# Altium schematic sheet BT2.SchDoc
size A4; SheetNumber: 3; SheetTotal: 3
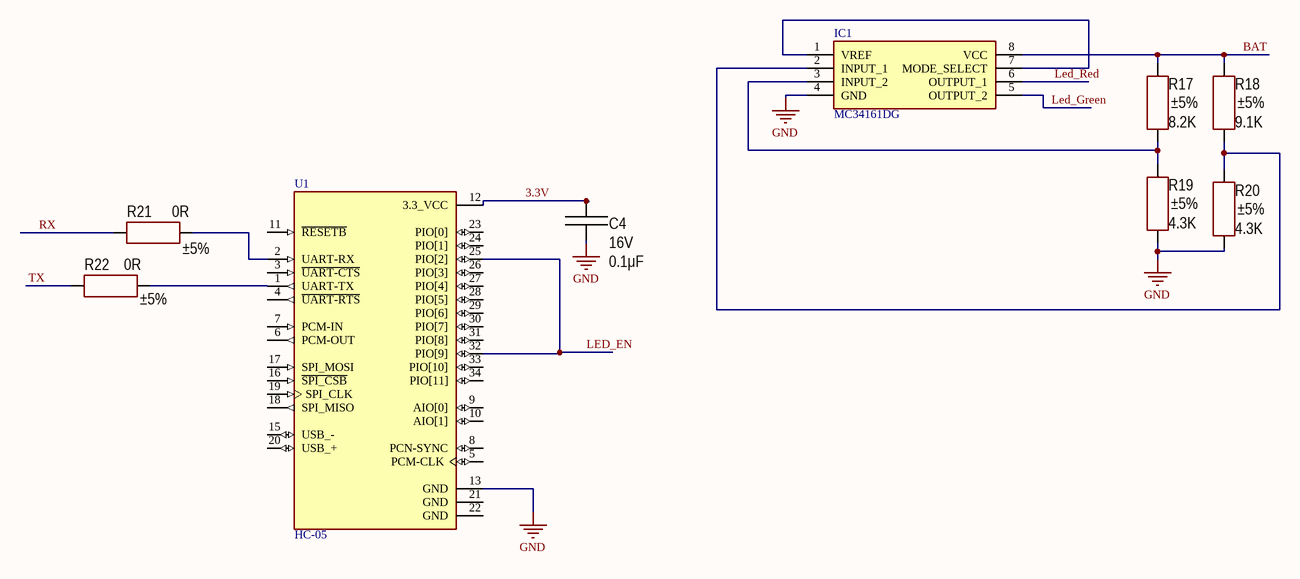
[diagram p0: BT2.SchDoc]

## Parts
C4  value 0.1μF  Voltage: 16V  [CAP: 0805]
IC1  MC34161DG  [SOIC127P600X175-8N]
R17  value 8.2K  Tolerance: ±5%  [RES: 0805]
R18  value 9.1K  Tolerance: ±5%  [RES: 0805]
R19  value 4.3K  Tolerance: ±5%  [RES: 0805]
R20  value 4.3K  Tolerance: ±5%  [RES: 0805]
R21  value 0R  Tolerance: ±5%  [RES: 0805]
R22  value 0R  Tolerance: ±5%  [RES: 0805]
U1  HC-05  [XCVR_HC-05]

## Nets
GND: C4.1 IC1.4(GND) R19.1 R20.1 U1.13(GND)
3.3V: C4.2 U1.12(3.3_VCC)
BAT: IC1.8(VCC) R17.2 R18.2
LED_EN: U1.25(PIO[2]) U1.32(PIO[9])
Led_Green: IC1.5(OUTPUT_2)
Led_Red: IC1.6(OUTPUT_1)
RX: R21.1
TX: R22.1
NetIC1_1: IC1.1(VREF) IC1.7(MODE_SELECT)
NetIC1_2: IC1.2(INPUT_1) R18.1 R20.2
NetIC1_3: IC1.3(INPUT_2) R17.1 R19.2
NetR21_2: R21.2 U1.2(UART-RX)
NetR22_2: R22.2 U1.1(UART-TX)

Not connected (* = marked no-connect by the designer): U1 3(~{UART-CTS}) 4(~{UART-RTS}) 5(PCM-CLK) 6(PCM-OUT) 7(PCM-IN) 8(PCN-SYNC) 9(AIO[0]) 10(AIO[1]) 11(~{RESETB}) 15(USB_-) 16(~{SPI_CSB}) 17(SPI_MOSI) 18(SPI_MISO) 19(SPI_CLK) 20(USB_+) 21(GND) 22(GND) 23(PIO[0]) 24(PIO[1]) 26(PIO[3]) 27(PIO[4]) 28(PIO[5]) 29(PIO[6]) 30(PIO[7]) 31(PIO[8]) 33(PIO[10]) 34(PIO[11])

## Library data of the parts
C4 = Ceramic_0805: Manufacturer: Yageo; PartNumber: CC0805KRX7R7BB104; ValueManufacturerPartNumber: Ceramic capacitor, 0.1μF, X7R, ±10%, 16V, 0805, -55...+125°C; TypeCapacitor: Ceramic capacitor; Tolerance: ±10%; TypeDielectric: X7R; Package: 0805; HelpURL: https://www.digikey.com/product-detail/en/yageo/CC0805KRX7R7BB104/311-1142-1-ND/303052; Temperature: -55...+125°C
IC1 = MC34161DG: Integrated Circuit; Manufacturer_Name: onsemi; Datasheet Link: https://www.onsemi.com/pub/Collateral/MC34161-D.PDF; Height: 1.75mm; Manufacturer_Part_Number: MC34161DG; Mouser Part Number: 863-MC34161DG; Mouser Price/Stock: https://www.mouser.co.uk/ProductDetail/onsemi/MC34161DG?qs=dFKnUM%2FquJa4H7AUsI3jVA%3D%3D; Arrow Part Number: MC34161DG; Arrow Price/Stock: https://www.arrow.com/en/products/mc34161dg/on-semiconductor?region=europe
R17 = Resistor_0805: Manufacturer: Yageo; PartNumber: RC0805JR-078K2L; ValueManufacturerPartNumber: Resistor film, 8.2K, ±5%, 0805, 0.125W, -55...+125°C; TypeResistor: Resistor film; Power: 0.125W; Package: 0805; HelpURL: https://www.digikey.com/product-detail/en/yageo/RC0805JR-07100RL/311-100ARCT-ND/731185; Temperature: -55...+125°C
R18 = Resistor_0805: Manufacturer: Yageo; PartNumber: RC0805JR-079K1L; ValueManufacturerPartNumber: Resistor film, 9.1K, ±5%, 0805, 0.125W, -55...+125°C; TypeResistor: Resistor film; Power: 0.125W; Package: 0805; HelpURL: https://www.digikey.com/product-detail/en/yageo/RC0805JR-07100RL/311-100ARCT-ND/731185; Temperature: -55...+125°C
R19 R20 = Resistor_0805: Manufacturer: Yageo; PartNumber: RC0805JR-074K3L; ValueManufacturerPartNumber: Resistor film, 4.3K, ±5%, 0805, 0.125W, -55...+125°C; TypeResistor: Resistor film; Power: 0.125W; Package: 0805; HelpURL: https://www.digikey.com/product-detail/en/yageo/RC0805JR-07100RL/311-100ARCT-ND/731185; Temperature: -55...+125°C
R21 R22 = Resistor_0805: Manufacturer: Yageo; PartNumber: RC0805JR-070RL; ValueManufacturerPartNumber: Resistor film, 0R, ±5%, 0805, 0.125W, -55...+125°C; TypeResistor: Resistor film; Power: 0.125W; Package: 0805; HelpURL: https://www.digikey.com/product-detail/en/yageo/RC0805JR-07100RL/311-100ARCT-ND/731185; Temperature: -55...+125°C
U1 = HC-05: Bluetooth to Serial Port Module; MF: ITead Studio; SnapEDA_Link: https://www.snapeda.com/parts/HC-05/ITEAD/view-part/?ref=snap; Package: Module ITead Studio; Value: *; MP: HC-05; Check_prices: https://www.snapeda.com/parts/HC-05/ITEAD/view-part/?ref=eda